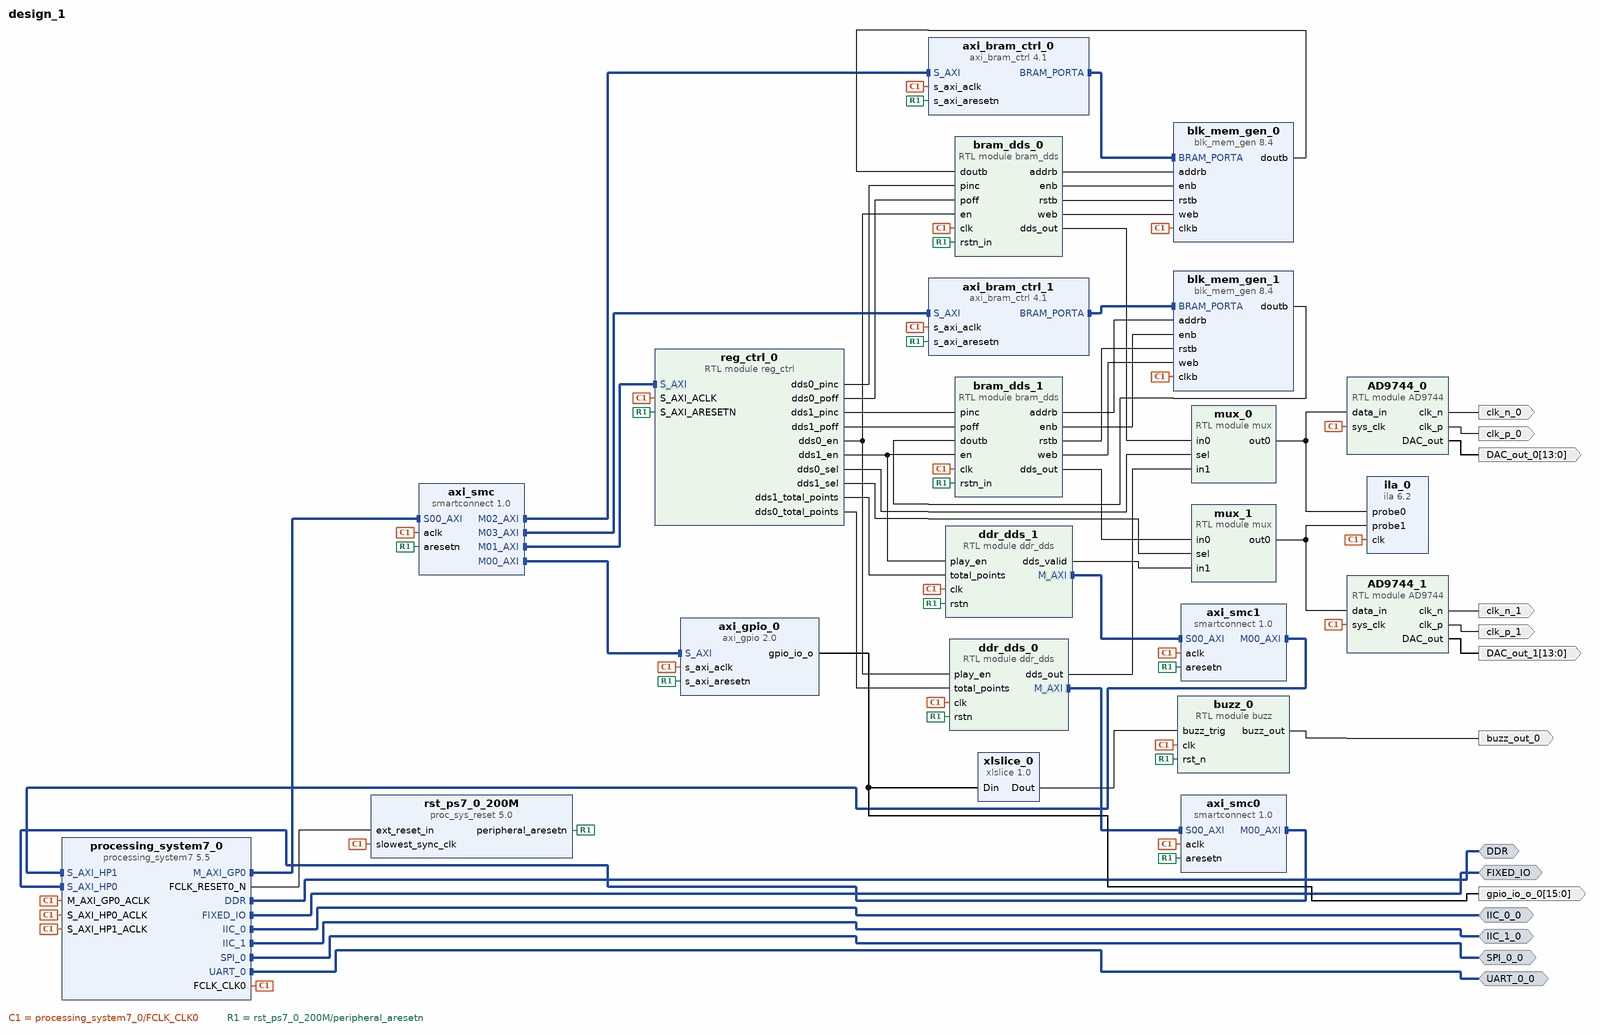
[diagram p0: block diagram of the top level]
# Vivado block design design_1, xc7z010clg400-2, Vivado 2024.2
create_bd_design design_1

create_bd_intf_port -mode Master -vlnv xilinx.com:interface:ddrx_rtl:1.0 DDR
create_bd_intf_port -mode Master -vlnv xilinx.com:display_processing_system7:fixedio_rtl:1.0 FIXED_IO
create_bd_intf_port -mode Master -vlnv xilinx.com:interface:uart_rtl:1.0 UART_0_0
create_bd_intf_port -mode Master -vlnv xilinx.com:interface:iic_rtl:1.0 IIC_1_0
create_bd_intf_port -mode Master -vlnv xilinx.com:interface:iic_rtl:1.0 IIC_0_0
create_bd_intf_port -mode Master -vlnv xilinx.com:interface:spi_rtl:1.0 SPI_0_0
create_bd_port -dir O -from 13 -to 0 DAC_out_0
create_bd_port -dir O -type clk clk_p_1
create_bd_port -dir O -type clk clk_n_0
create_bd_port -dir O -type clk clk_p_0
create_bd_port -dir O -from 13 -to 0 DAC_out_1
create_bd_port -dir O -type clk clk_n_1
create_bd_port -dir O buzz_out_0
create_bd_port -dir O -from 15 -to 0 gpio_io_o_0

create_bd_cell -type ip -vlnv xilinx.com:ip:processing_system7:5.5 processing_system7_0
set_property -dict [list \
  CONFIG.PCW_FPGA0_PERIPHERAL_FREQMHZ 200 \
  CONFIG.PCW_I2C0_I2C0_IO EMIO \
  CONFIG.PCW_I2C0_PERIPHERAL_ENABLE 1 \
  CONFIG.PCW_I2C1_I2C1_IO EMIO \
  CONFIG.PCW_I2C1_PERIPHERAL_ENABLE 1 \
  CONFIG.PCW_I2C_PERIPHERAL_FREQMHZ 111.111115 \
  CONFIG.PCW_QSPI_GRP_SINGLE_SS_ENABLE 1 \
  CONFIG.PCW_QSPI_GRP_SINGLE_SS_IO {MIO 1 .. 6} \
  CONFIG.PCW_QSPI_PERIPHERAL_ENABLE 1 \
  CONFIG.PCW_QSPI_QSPI_IO {MIO 1 .. 6} \
  CONFIG.PCW_SD0_GRP_CD_ENABLE 0 \
  CONFIG.PCW_SD0_GRP_WP_ENABLE 0 \
  CONFIG.PCW_SD0_PERIPHERAL_ENABLE 1 \
  CONFIG.PCW_SD0_SD0_IO {MIO 40 .. 45} \
  CONFIG.PCW_SDIO_PERIPHERAL_FREQMHZ 100 \
  CONFIG.PCW_SINGLE_QSPI_DATA_MODE x4 \
  CONFIG.PCW_SPI0_PERIPHERAL_ENABLE 1 \
  CONFIG.PCW_SPI0_SPI0_IO EMIO \
  CONFIG.PCW_TTC0_PERIPHERAL_ENABLE 1 \
  CONFIG.PCW_TTC0_TTC0_IO EMIO \
  CONFIG.PCW_UART0_PERIPHERAL_ENABLE 1 \
  CONFIG.PCW_UART0_UART0_IO EMIO \
  CONFIG.PCW_UART_PERIPHERAL_FREQMHZ 100 \
  CONFIG.PCW_UIPARAM_DDR_BUS_WIDTH {16 Bit} \
  CONFIG.PCW_UIPARAM_DDR_PARTNO {MT41K256M16 RE-125} \
  CONFIG.PCW_USE_S_AXI_HP0 1 \
  CONFIG.PCW_USE_S_AXI_HP1 1 \
] [get_bd_cells processing_system7_0]
# 89 more settings of processing_system7_0 are not shown: defaults, MIO pin electricals, DDR timing, and values the tool derives
create_bd_cell -type module -reference AD9744 AD9744_0
create_bd_cell -type module -reference AD9744 AD9744_1
create_bd_cell -type ip -vlnv xilinx.com:ip:axi_gpio:2.0 axi_gpio_0
set_property -dict {CONFIG.C_ALL_INPUTS 0 CONFIG.C_ALL_OUTPUTS 0 CONFIG.C_GPIO_WIDTH 16} [get_bd_cells axi_gpio_0]
create_bd_cell -type ip -vlnv xilinx.com:ip:proc_sys_reset:5.0 rst_ps7_0_200M
create_bd_cell -type ip -vlnv xilinx.com:ip:ila:6.2 ila_0
set_property -dict [list \
  CONFIG.C_DATA_DEPTH 4096 \
  CONFIG.C_EN_STRG_QUAL 1 \
  CONFIG.C_MONITOR_TYPE Native \
  CONFIG.C_NUM_OF_PROBES 2 \
  CONFIG.C_PROBE0_WIDTH 16 \
  CONFIG.C_PROBE1_WIDTH 16 \
  CONFIG.C_PROBE2_WIDTH 1 \
  CONFIG.C_PROBE3_WIDTH 1 \
  CONFIG.C_PROBE4_WIDTH 1 \
  CONFIG.C_PROBE6_WIDTH 1 \
  CONFIG.C_PROBE7_WIDTH 1 \
  CONFIG.C_PROBE8_WIDTH 1 \
] [get_bd_cells ila_0]
create_bd_cell -type module -reference reg_ctrl reg_ctrl_0
create_bd_cell -type ip -vlnv xilinx.com:ip:smartconnect:1.0 axi_smc
set_property -dict {CONFIG.NUM_MI 4 CONFIG.NUM_SI 1} [get_bd_cells axi_smc]
create_bd_cell -type ip -vlnv xilinx.com:ip:smartconnect:1.0 axi_smc0
set_property -dict {CONFIG.NUM_MI 1 CONFIG.NUM_SI 1} [get_bd_cells axi_smc0]
create_bd_cell -type ip -vlnv xilinx.com:ip:smartconnect:1.0 axi_smc1
set_property -dict {CONFIG.NUM_MI 1 CONFIG.NUM_SI 1} [get_bd_cells axi_smc1]
create_bd_cell -type module -reference ddr_dds ddr_dds_0
set_property -dict {CONFIG.BASE_ADDR 0x18000000} [get_bd_cells ddr_dds_0]
create_bd_cell -type module -reference ddr_dds ddr_dds_1
set_property -dict {CONFIG.BASE_ADDR 0x1C000000} [get_bd_cells ddr_dds_1]
create_bd_cell -type module -reference mux mux_0
create_bd_cell -type module -reference mux mux_1
create_bd_cell -type module -reference bram_dds bram_dds_0
create_bd_cell -type ip -vlnv xilinx.com:ip:axi_bram_ctrl:4.1 axi_bram_ctrl_0
set_property -dict {CONFIG.SINGLE_PORT_BRAM 1} [get_bd_cells axi_bram_ctrl_0]
create_bd_cell -type ip -vlnv xilinx.com:ip:blk_mem_gen:8.4 blk_mem_gen_0
set_property -dict {CONFIG.EN_SAFETY_CKT false CONFIG.Memory_Type True_Dual_Port_RAM} [get_bd_cells blk_mem_gen_0]
create_bd_cell -type ip -vlnv xilinx.com:ip:axi_bram_ctrl:4.1 axi_bram_ctrl_1
set_property -dict {CONFIG.SINGLE_PORT_BRAM 1} [get_bd_cells axi_bram_ctrl_1]
create_bd_cell -type ip -vlnv xilinx.com:ip:blk_mem_gen:8.4 blk_mem_gen_1
set_property -dict {CONFIG.EN_SAFETY_CKT false CONFIG.Memory_Type True_Dual_Port_RAM} [get_bd_cells blk_mem_gen_1]
create_bd_cell -type module -reference bram_dds bram_dds_1
create_bd_cell -type ip -vlnv xilinx.com:ip:xlslice:1.0 xlslice_0
set_property -dict {CONFIG.DIN_TO 10 CONFIG.DIN_WIDTH 16} [get_bd_cells xlslice_0]
create_bd_cell -type module -reference buzz buzz_0

# ---- connections ----

connect_bd_intf_net [get_bd_intf_pins blk_mem_gen_0/BRAM_PORTA] [get_bd_intf_pins axi_bram_ctrl_0/BRAM_PORTA]
connect_bd_intf_net [get_bd_intf_pins axi_bram_ctrl_1/BRAM_PORTA] [get_bd_intf_pins blk_mem_gen_1/BRAM_PORTA]
connect_bd_intf_net [get_bd_intf_pins axi_smc0/M00_AXI] [get_bd_intf_pins processing_system7_0/S_AXI_HP0]
connect_bd_intf_net [get_bd_intf_pins processing_system7_0/S_AXI_HP1] [get_bd_intf_pins axi_smc1/M00_AXI]
connect_bd_intf_net [get_bd_intf_pins axi_smc/M00_AXI] [get_bd_intf_pins axi_gpio_0/S_AXI]
connect_bd_intf_net [get_bd_intf_pins axi_smc/M01_AXI] [get_bd_intf_pins reg_ctrl_0/S_AXI]
connect_bd_intf_net [get_bd_intf_pins axi_smc/M02_AXI] [get_bd_intf_pins axi_bram_ctrl_0/S_AXI]
connect_bd_intf_net [get_bd_intf_pins axi_smc/M03_AXI] [get_bd_intf_pins axi_bram_ctrl_1/S_AXI]
connect_bd_intf_net [get_bd_intf_pins ddr_dds_0/M_AXI] [get_bd_intf_pins axi_smc0/S00_AXI]
connect_bd_intf_net [get_bd_intf_pins ddr_dds_1/M_AXI] [get_bd_intf_pins axi_smc1/S00_AXI]
connect_bd_intf_net [get_bd_intf_ports DDR] [get_bd_intf_pins processing_system7_0/DDR]
connect_bd_intf_net [get_bd_intf_ports FIXED_IO] [get_bd_intf_pins processing_system7_0/FIXED_IO]
connect_bd_intf_net [get_bd_intf_ports IIC_0_0] [get_bd_intf_pins processing_system7_0/IIC_0]
connect_bd_intf_net [get_bd_intf_ports IIC_1_0] [get_bd_intf_pins processing_system7_0/IIC_1]
connect_bd_intf_net [get_bd_intf_pins processing_system7_0/M_AXI_GP0] [get_bd_intf_pins axi_smc/S00_AXI]
connect_bd_intf_net [get_bd_intf_ports SPI_0_0] [get_bd_intf_pins processing_system7_0/SPI_0]
connect_bd_intf_net [get_bd_intf_ports UART_0_0] [get_bd_intf_pins processing_system7_0/UART_0]
connect_bd_net [get_bd_pins AD9744_0/DAC_out] [get_bd_ports DAC_out_0]
connect_bd_net [get_bd_pins AD9744_0/clk_n] [get_bd_ports clk_n_0]
connect_bd_net [get_bd_pins AD9744_0/clk_p] [get_bd_ports clk_p_0]
connect_bd_net [get_bd_pins AD9744_1/DAC_out] [get_bd_ports DAC_out_1]
connect_bd_net [get_bd_pins AD9744_1/clk_n] [get_bd_ports clk_n_1]
connect_bd_net [get_bd_pins AD9744_1/clk_p] [get_bd_ports clk_p_1]
connect_bd_net [get_bd_pins axi_gpio_0/gpio_io_o] [get_bd_ports gpio_io_o_0] [get_bd_pins xlslice_0/Din]
connect_bd_net [get_bd_pins blk_mem_gen_0/doutb] [get_bd_pins bram_dds_0/doutb]
connect_bd_net [get_bd_pins blk_mem_gen_1/doutb] [get_bd_pins bram_dds_1/doutb]
connect_bd_net [get_bd_pins bram_dds_0/addrb] [get_bd_pins blk_mem_gen_0/addrb]
connect_bd_net [get_bd_pins bram_dds_0/dds_out] [get_bd_pins mux_0/in0]
connect_bd_net [get_bd_pins bram_dds_0/enb] [get_bd_pins blk_mem_gen_0/enb]
connect_bd_net [get_bd_pins bram_dds_0/rstb] [get_bd_pins blk_mem_gen_0/rstb]
connect_bd_net [get_bd_pins bram_dds_0/web] [get_bd_pins blk_mem_gen_0/web]
connect_bd_net [get_bd_pins bram_dds_1/addrb] [get_bd_pins blk_mem_gen_1/addrb]
connect_bd_net [get_bd_pins bram_dds_1/dds_out] [get_bd_pins mux_1/in0]
connect_bd_net [get_bd_pins bram_dds_1/enb] [get_bd_pins blk_mem_gen_1/enb]
connect_bd_net [get_bd_pins bram_dds_1/rstb] [get_bd_pins blk_mem_gen_1/rstb]
connect_bd_net [get_bd_pins bram_dds_1/web] [get_bd_pins blk_mem_gen_1/web]
connect_bd_net [get_bd_pins buzz_0/buzz_out] [get_bd_ports buzz_out_0]
connect_bd_net [get_bd_pins ddr_dds_0/dds_out] [get_bd_pins mux_0/in1]
connect_bd_net [get_bd_pins ddr_dds_1/dds_valid] [get_bd_pins mux_1/in1]
connect_bd_net -net dds_output_0_dds_out [get_bd_pins mux_0/out0] [get_bd_pins ila_0/probe0] [get_bd_pins AD9744_0/data_in]
connect_bd_net -net my_dds_1_dds_out [get_bd_pins mux_1/out0] [get_bd_pins AD9744_1/data_in] [get_bd_pins ila_0/probe1]
connect_bd_net [get_bd_pins processing_system7_0/FCLK_CLK0] \
  [get_bd_pins processing_system7_0/M_AXI_GP0_ACLK] [get_bd_pins AD9744_0/sys_clk] [get_bd_pins AD9744_1/sys_clk] \
  [get_bd_pins axi_gpio_0/s_axi_aclk] [get_bd_pins rst_ps7_0_200M/slowest_sync_clk] [get_bd_pins ila_0/clk] \
  [get_bd_pins axi_smc/aclk] [get_bd_pins processing_system7_0/S_AXI_HP0_ACLK] \
  [get_bd_pins processing_system7_0/S_AXI_HP1_ACLK] [get_bd_pins axi_smc1/aclk] [get_bd_pins axi_smc0/aclk] \
  [get_bd_pins reg_ctrl_0/S_AXI_ACLK] [get_bd_pins axi_bram_ctrl_0/s_axi_aclk] [get_bd_pins ddr_dds_0/clk] \
  [get_bd_pins ddr_dds_1/clk] [get_bd_pins blk_mem_gen_0/clkb] [get_bd_pins axi_bram_ctrl_1/s_axi_aclk] \
  [get_bd_pins blk_mem_gen_1/clkb] [get_bd_pins bram_dds_0/clk] [get_bd_pins bram_dds_1/clk] [get_bd_pins buzz_0/clk]
connect_bd_net [get_bd_pins processing_system7_0/FCLK_RESET0_N] [get_bd_pins rst_ps7_0_200M/ext_reset_in]
connect_bd_net [get_bd_pins reg_ctrl_0/dds0_en] [get_bd_pins ddr_dds_0/play_en] [get_bd_pins bram_dds_0/en]
connect_bd_net [get_bd_pins reg_ctrl_0/dds0_pinc] [get_bd_pins bram_dds_0/pinc]
connect_bd_net [get_bd_pins reg_ctrl_0/dds0_poff] [get_bd_pins bram_dds_0/poff]
connect_bd_net [get_bd_pins reg_ctrl_0/dds0_sel] [get_bd_pins mux_0/sel]
connect_bd_net [get_bd_pins reg_ctrl_0/dds0_total_points] [get_bd_pins ddr_dds_0/total_points]
connect_bd_net [get_bd_pins reg_ctrl_0/dds1_en] [get_bd_pins ddr_dds_1/play_en] [get_bd_pins bram_dds_1/en]
connect_bd_net [get_bd_pins reg_ctrl_0/dds1_pinc] [get_bd_pins bram_dds_1/pinc]
connect_bd_net [get_bd_pins reg_ctrl_0/dds1_poff] [get_bd_pins bram_dds_1/poff]
connect_bd_net [get_bd_pins reg_ctrl_0/dds1_sel] [get_bd_pins mux_1/sel]
connect_bd_net [get_bd_pins reg_ctrl_0/dds1_total_points] [get_bd_pins ddr_dds_1/total_points]
connect_bd_net [get_bd_pins rst_ps7_0_200M/peripheral_aresetn] \
  [get_bd_pins axi_gpio_0/s_axi_aresetn] [get_bd_pins axi_smc/aresetn] [get_bd_pins axi_smc0/aresetn] \
  [get_bd_pins axi_smc1/aresetn] [get_bd_pins reg_ctrl_0/S_AXI_ARESETN] [get_bd_pins axi_bram_ctrl_0/s_axi_aresetn] \
  [get_bd_pins ddr_dds_0/rstn] [get_bd_pins ddr_dds_1/rstn] [get_bd_pins axi_bram_ctrl_1/s_axi_aresetn] \
  [get_bd_pins bram_dds_0/rstn_in] [get_bd_pins bram_dds_1/rstn_in] [get_bd_pins buzz_0/rst_n]
connect_bd_net [get_bd_pins xlslice_0/Dout] [get_bd_pins buzz_0/buzz_trig]
set_property HDL_ATTRIBUTE.BMM_INFO_PROCESSOR {arm > design_1 axi_bram_ctrl_0 design_1 axi_bram_ctrl_1} [get_bd_cells processing_system7_0]
set_property HDL_ATTRIBUTE.KEEP_HIERARCHY yes [get_bd_cells processing_system7_0]
set_property HDL_ATTRIBUTE.BMM_INFO_ADDRESS_SPACE {byte  0x42000000 32 > design_1 blk_mem_gen_0} [get_bd_cells axi_bram_ctrl_0]
set_property HDL_ATTRIBUTE.KEEP_HIERARCHY yes [get_bd_cells axi_bram_ctrl_0]
set_property HDL_ATTRIBUTE.BMM_INFO_ADDRESS_SPACE {byte  0x44000000 32 > design_1 blk_mem_gen_1} [get_bd_cells axi_bram_ctrl_1]
set_property HDL_ATTRIBUTE.KEEP_HIERARCHY yes [get_bd_cells axi_bram_ctrl_1]

# ---- address map ----
assign_bd_address -offset 0x00000000 -range 512M -target_address_space [get_bd_addr_spaces ddr_dds_0/M_AXI] [get_bd_addr_segs processing_system7_0/S_AXI_HP0/HP0_DDR_LOWOCM]
assign_bd_address -offset 0x00000000 -range 512M -target_address_space [get_bd_addr_spaces ddr_dds_1/M_AXI] [get_bd_addr_segs processing_system7_0/S_AXI_HP1/HP1_DDR_LOWOCM]
assign_bd_address -offset 0x40000000 -range 4K -target_address_space [get_bd_addr_spaces processing_system7_0/Data] [get_bd_addr_segs reg_ctrl_0/S_AXI/reg0]
assign_bd_address -offset 0x41200000 -range 64K -target_address_space [get_bd_addr_spaces processing_system7_0/Data] [get_bd_addr_segs axi_gpio_0/S_AXI/Reg]
assign_bd_address -offset 0x42000000 -range 64K -target_address_space [get_bd_addr_spaces processing_system7_0/Data] [get_bd_addr_segs axi_bram_ctrl_0/S_AXI/Mem0]
assign_bd_address -offset 0x44000000 -range 64K -target_address_space [get_bd_addr_spaces processing_system7_0/Data] [get_bd_addr_segs axi_bram_ctrl_1/S_AXI/Mem0]
exclude_bd_addr_seg -offset 0x00000000 -range 1 -target_address_space [get_bd_addr_spaces processing_system7_0/Data] [get_bd_addr_segs processing_system7_0/S_AXI_HP0/HP0_DDR_LOWOCM]
exclude_bd_addr_seg -offset 0x00000000 -range 1 -target_address_space [get_bd_addr_spaces processing_system7_0/Data] [get_bd_addr_segs processing_system7_0/S_AXI_HP1/HP1_DDR_LOWOCM]

validate_bd_design
save_bd_design
